# EAGLE design Gateway (EAGLE 9.6.2)
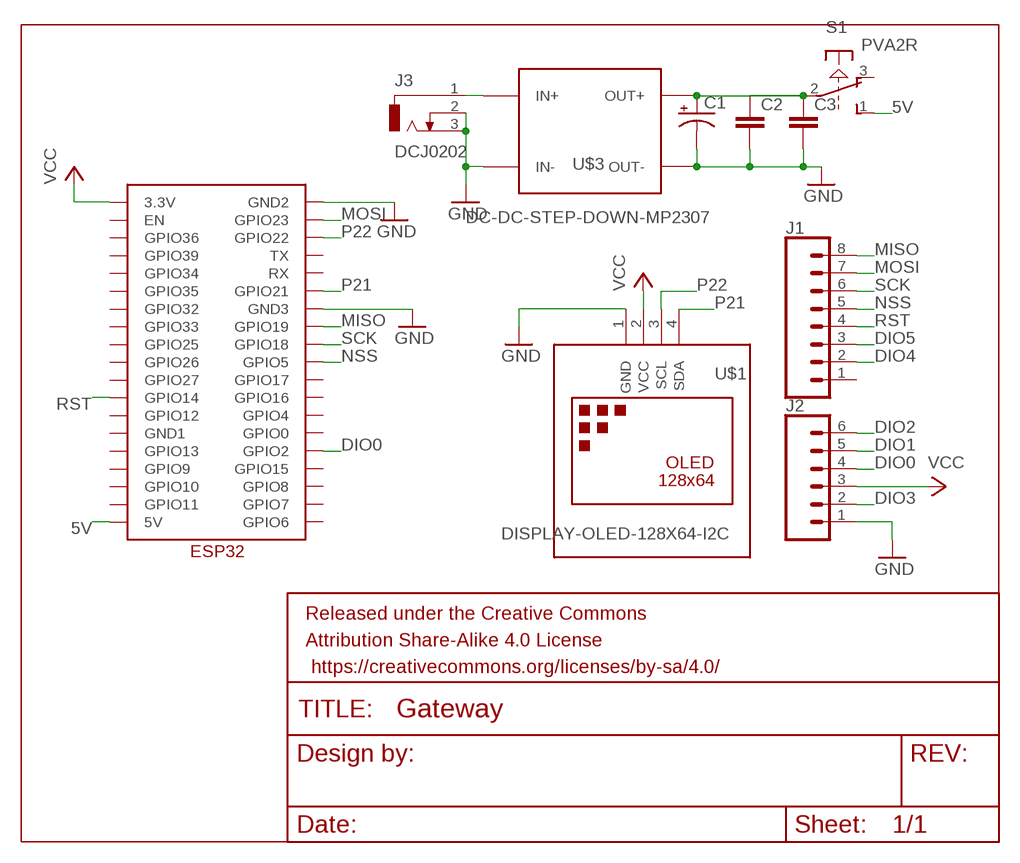
[diagram p0: schematic, sheet 1]

## Parts
C1  CPOL-USE2,5-6E  [E2,5-6E]
C2  C-EUC1206  [C1206]
C3  C-EUC1206  [C1206]
FRAME1  FRAME-LEDGER  [CREATIVE_COMMONS]
J1  CONN_08"  [1X08]
J2  CONN_06SILK_FEMALE_PTH  [1X06]
J3  DCJ0202  [DCJ0202]
S1  PVA2R  [PVA2R]
U$1  DISPLAY-OLED-128X64-I2C  [DISPLAY-OLED-128X64-I2C]
U$2  ESP32  [ESP32]
U$3  DC-DC-STEP-DOWN-MP2307  [DC-DC-STEP-DOWN-MP2307]

## Nets
5V: S1.1(1:S) U$2.5V
DIO0: J2.4 U$2.GPIO2
DIO1: J2.5
DIO2: J2.6
DIO3: J2.2
DIO4: J1.2
DIO5: J1.3
GND: C1.- C2.2 C3.2 J2.1 J3.2 J3.3 U$1.1(GND) U$2.GND2 U$2.GND3 U$3.IN- U$3.OUT-
MISO: J1.8 U$2.GPIO19
MOSI: J1.7 U$2.GPIO23
N$1: C1.+ C2.1 C3.1 S1.2(1:P) U$3.OUT+
N$2: J3.1 U$3.IN+
NSS: J1.5 U$2.GPIO5
P21: U$1.4(SDA) U$2.GPIO21
P22: U$1.3(SCL) U$2.GPIO22
RST: J1.4 U$2.GPIO14
SCK: J1.6 U$2.GPIO18
VCC: J2.3 U$1.2(VCC) U$2.3.3V
Unconnected: J1.1 S1.3(1:O) S1.4(2:S) S1.5(2:P) S1.6(2:O) U$2.EN U$2.GND1 U$2.GPIO0 U$2.GPIO4 U$2.GPIO6 U$2.GPIO7 U$2.GPIO8 U$2.GPIO9 U$2.GPIO10 U$2.GPIO11 U$2.GPIO12 U$2.GPIO13 U$2.GPIO15 U$2.GPIO16 U$2.GPIO17 U$2.GPIO25 U$2.GPIO26 U$2.GPIO27 U$2.GPIO32 U$2.GPIO33 U$2.GPIO34 U$2.GPIO35 U$2.GPIO36 U$2.GPIO39 U$2.RX U$2.TX

## Library data of the parts
C1 = rcl:CPOL-US: POLARIZED CAPACITOR, American symbol; SPICEPREFIX: C
C2 C3 = rcl:C-EU: CAPACITOR, European symbol; SPICEPREFIX: C
FRAME1 = SparkFun-Aesthetics:FRAME-LEDGER: Schematic Frame - Ledger Standard 11x14 US Ledger frame
J1 = SparkFun-Connectors:CONN_08: Multi connection point. Often used as Generic Header-pin footprint for 0.1 inch spaced/style header connections On any of the 0.1 inch spaced packages, you can populate with these: Break Away Headers - Straight <https://www.sparkfun.com/products/116> (PRT-00116) Break Away Male Headers - Right Angle <https://www.sparkfun.com/products/553> (PRT-00553) Female Headers <https://www.sparkfun.com/products/115> (PRT-00115) Break Away Headers - Machine Pin <https://www.sparkfun.com/products/117> (PRT-00117) Break Away Female Headers - Swiss Machine Pin <https://www.sparkfun.com/products/743> (PRT-00743) Arduino Stackable Header - 8 Pin <https://www.sparkfun.com/products/9279> (PRT-09279) For SCREWTERMINALS and SPRING TERMINALS visit here: Screw Terimnals on SparkFun.com <https://www.sparkfun.com/search/results?term=Screw+Terminals> (5mm/3.5mm/2.54mm spacing) This device is also useful as a general connection point to wire up your design to another part of your project. Our various solder wires solder well into these plated through hole pads. Hook-Up Wire - Assortment (Stranded, 22 AWG) <https://www.sparkfun.com/products/11375> (PRT-11375) Hook-Up Wire - Assortment (Solid Core, 22 AWG) <https://www.sparkfun.com/products/11367> (PRT-11367) View the entire wire category on our website here <https://www.sparkfun.com/categories/141> Special notes: Molex polarized connector foot print use with SKU : PRT-08231 with associated crimp pins and housings. 1MM SMD Version SKU: PRT-10208 NOTES ON THE VARIANTS LOCK and LOCK_LONGPADS... This footprint was designed to help hold the alignment of a through-hole component (i.e. 6-pin header) while soldering it into place. You may notice that each hole has been shifted either up or down by 0.005 of an inch from it's more standard position (which is a perfectly straight line). This slight alteration caused the pins (the squares in the middle) to touch the edges of the holes. Because they are alternating, it causes a "brace" to hold the component in place. 0.005 has proven to be the perfect amount of "off-center" position when using our standard breakaway headers. Although looks a little odd when you look at the bare footprint, once you have a header in there, the alteration is very hard to notice. Also,if you push a header all the way into place, it is covered up entirely on the bottom side.; PROD_ID: CONN-08438
J2 = SparkFun-Connectors:CONN_06: Multi connection point. Often used as Generic Header-pin footprint for 0.1 inch spaced/style header connections On any of the 0.1 inch spaced packages, you can populate with these: Break Away Headers - Straight <https://www.sparkfun.com/products/116> (PRT-00116) Break Away Male Headers - Right Angle <https://www.sparkfun.com/products/553> (PRT-00553) Female Headers <https://www.sparkfun.com/products/115> (PRT-00115) Break Away Headers - Machine Pin <https://www.sparkfun.com/products/117> (PRT-00117) Break Away Female Headers - Swiss Machine Pin <https://www.sparkfun.com/products/743> (PRT-00743) Arduino Stackable Header - 6 Pin <https://www.sparkfun.com/products/9280> (PRT-09280) For SCREWTERMINALS and SPRING TERMINALS visit here: Screw Terimnals on SparkFun.com <https://www.sparkfun.com/search/results?term=Screw+Terminals> (5mm/3.5mm/2.54mm spacing) This device is also useful as a general connection point to wire up your design to another part of your project. Our various solder wires solder well into these plated through hole pads. Hook-Up Wire - Assortment (Stranded, 22 AWG) <https://www.sparkfun.com/products/11375> (PRT-11375) Hook-Up Wire - Assortment (Solid Core, 22 AWG) <https://www.sparkfun.com/products/11367> (PRT-11367) View the entire wire category on our website here <https://www.sparkfun.com/categories/141>; PROD_ID: CONN-08437
J3 = con-jack:DCJ0202: DC POWER JACK Source: DCJ0202.pdf; OC_FARNELL: unknown; OC_NEWARK: unknown
S1 = switch-misc:PVA2R: ITT SWITCH
U$1 = diy-modules:DISPLAY-OLED-128X64-I2C: 128x64 Dot Matrix OLED Module based on SSD1306 chip Variant with I2C interface More details available here: http://www.instructables.com/id/Monochrome-096-i2c-OLED-display-with-arduino-SSD13/ SSD1306 datasheet: https://cdn-shop.adafruit.com/datasheets/SSD1306.pdf Click here to find device on ebay.com <http://www.ebay.com/sch/oled+display+128x64+iic> Note: There are two variants: I2C and SPI. Search for the proper version.
U$2 = ESP32:ESP32
U$3 = diy-modules:DC-DC-STEP-DOWN-MP2307: DC/DC Step-Down Regulator based on MP2307DN chip MP2307 datasheet available here: https://cdn-shop.adafruit.com/datasheets/MP2307_r1.9.pdf Click here to find device on ebay.com <http://www.ebay.com/sch/dc+dc+3a+mini+converter>

## Board
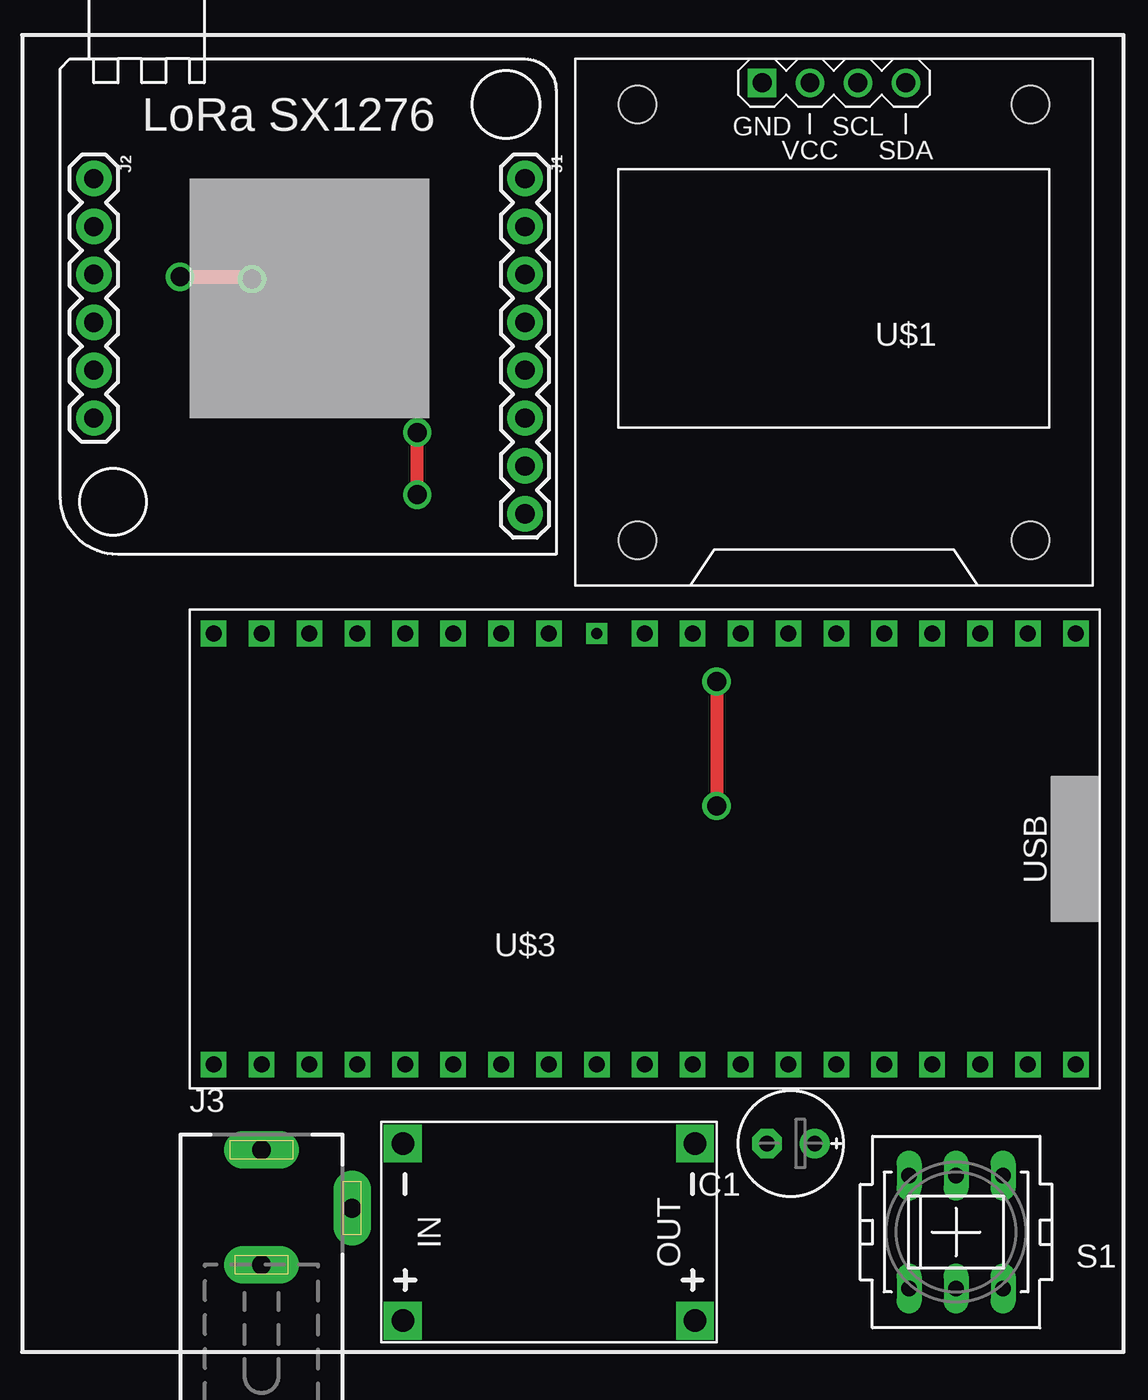
[diagram p1: board, top side]
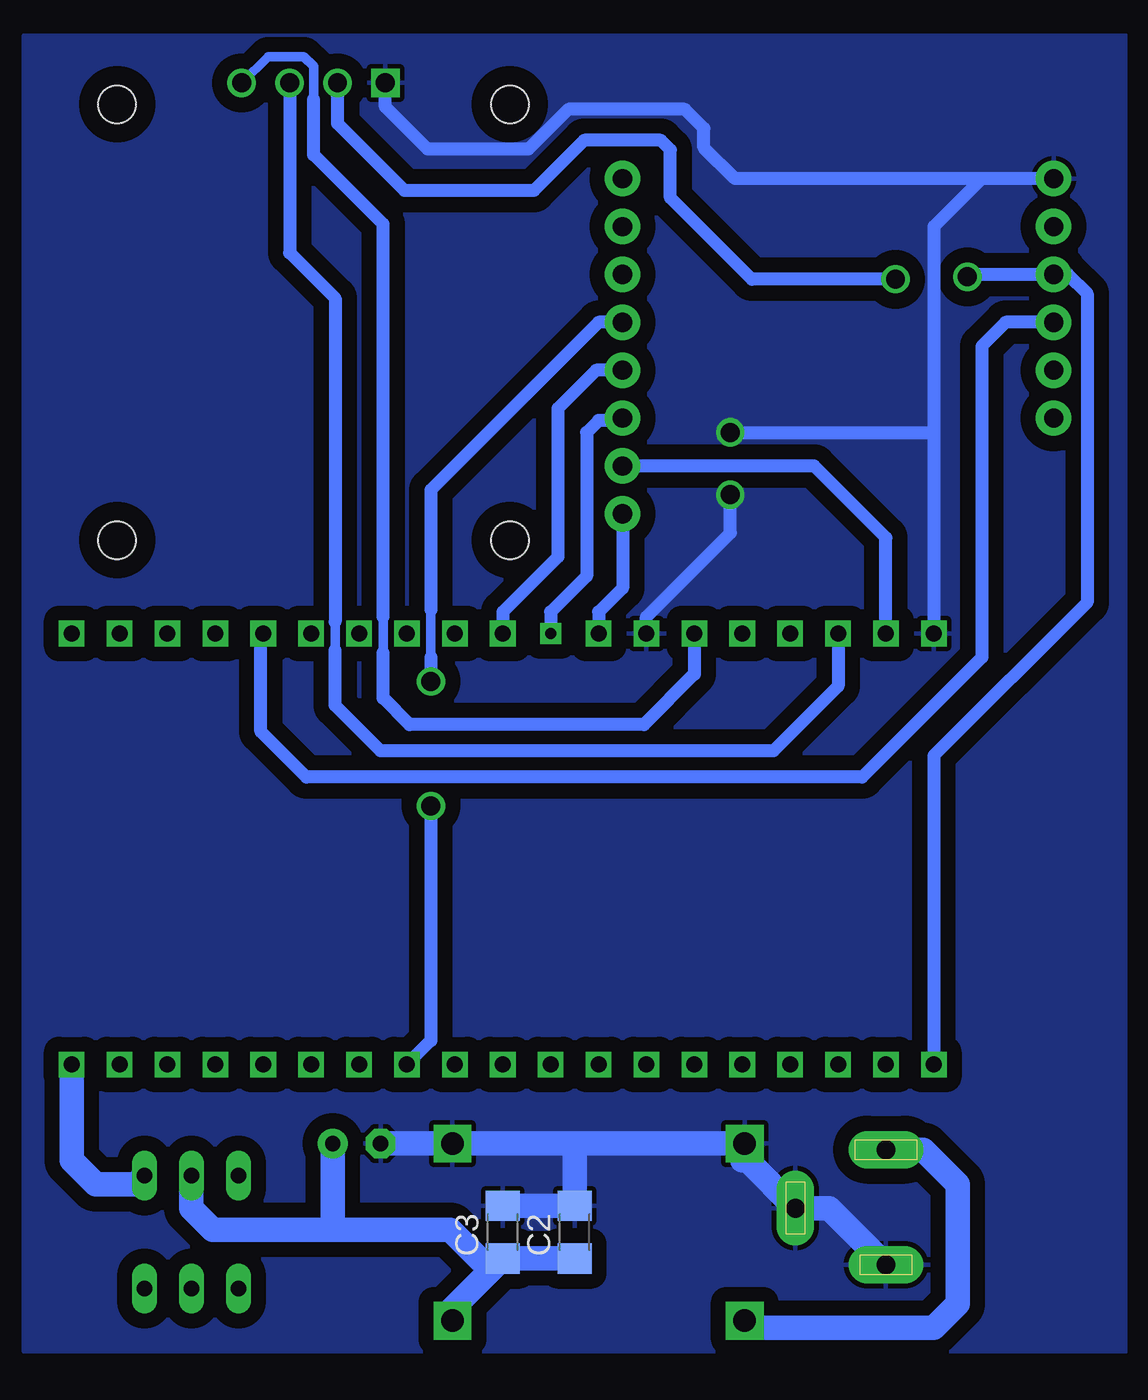
[diagram p2: board, bottom side, seen from below]

No outline drawn. Coordinates in mm, seen from the top.
Copper layers (1*16): Top 0.035mm / dielectric 1.5mm / Bottom 0.035mm
Design rules "default": minimum track width 6mil, minimum drill 0.35mm, track to track 6mil, track to pad 6mil, pad to pad 6mil, via to via 6mil, smd to smd 6mil, copper to edge 40mil, drill to drill 6mil, minimum pad ring 10mil, minimum via ring 8mil, stop-mask expansion 4mil, vias tented up to drill 0mil, thermal gap 10mil

### Footprints (pad centres in the part's own frame; a part is rotated, then mirrored left to right if it is on the bottom)
E2,5-6E = drill 0.813 pad 1.575: + -1.27,0 | drill 0.813 pad 1.575 octagon: - 1.27,0
C1206 = smd 1.6 x 1.8: 1 -1.4,0; 2 1.4,0
1X08 = drill 1.016 pad 1.88: 1 0,0; 2 2.54,0; 3 5.08,0; 4 7.62,0; 5 10.16,0; 6 12.7,0; 7 15.24,0; 8 17.78,0
1X06 = drill 1.016 pad 1.88: 1 0,0; 2 2.54,0; 3 5.08,0; 4 7.62,0; 5 10.16,0; 6 12.7,0
DCJ0202 = drill 1 pad 2 long: 1 0,3.1; 2 4.8,0; 3 0,-3
PVA2R = drill 0.813 long: 1 -2.997,2.489; 2 -2.997,0; 3 -2.997,-2.489; 4 2.997,2.489; 5 2.997,0; 6 2.997,-2.489
DISPLAY-OLED-128X64-I2C = drill 1 square: 1 -3.81,12.7 | drill 1: 2 -1.27,12.7; 3 1.27,12.7; 4 3.81,12.7 | hole 2: -10.414,11.557; 10.414,11.557; 10.414,-11.557; -10.414,-11.557
ESP32 = drill 0.85 square: 3.3V 1.27,46.99; 5V 1.27,1.27; EN 1.27,44.45; GND1 1.27,13.97; GND2 24.13,46.99; GND3 24.13,31.75; GPIO0 24.13,13.97; GPIO2 24.13,11.43; GPIO4 24.13,16.51; GPIO5 24.13,24.13; GPIO6 24.13,1.27; GPIO7 24.13,3.81; GPIO8 24.13,6.35; GPIO9 1.27,8.89; GPIO10 1.27,6.35; GPIO11 1.27,3.81; GPIO12 1.27,16.51; GPIO13 1.27,11.43; GPIO14 1.27,19.05; GPIO15 24.13,8.89; GPIO16 24.13,19.05; GPIO17 24.13,21.59; GPIO19 24.13,29.21; GPIO21 24.13,34.29; GPIO22 24.13,41.91; GPIO23 24.13,44.45; GPIO25 1.27,26.67; GPIO26 1.27,24.13; GPIO27 1.27,21.59; GPIO32 1.27,31.75; GPIO33 1.27,29.21; GPIO34 1.27,36.83; GPIO35 1.27,34.29; GPIO36 1.27,41.91; GPIO39 1.27,39.37; RX 24.13,36.83; TX 24.13,39.37 | drill 0.6 square: GPIO18 24.13,26.67
DC-DC-STEP-DOWN-MP2307 = drill 1.2 pad 2 square: IN+ -7.747,-4.699; IN- -7.747,4.699; OUT+ 7.747,-4.699; OUT- 7.747,4.699

### Placement (x,y rotation side)
C1  44.58,4.7 180 top
C2  33.02,0 90 bottom
C3  36.83,0 90 bottom
FRAME1  16.51,-29.21 0 top
J1  30.48,55.88 270 top
J2  7.62,55.88 270 top
J3  16.51,1.27 0 top
S1  53.34,0 270 top
U$1  46.86,48.26 0 top
U$2  60.96,7.62 90 top
U$3  31.75,0 0 top

### Tracks (layer width: path | path; a pad name or v marks a point on that pad's centre or on a via)
5V
  Bottom 1.3: U$2.5V 59.69,3.81 58.42,2.54 56.29,2.54 S1.1
DIO0
  Bottom 0.7: J2.4 10.16,48.26 11.43,46.99 11.43,30.48 17.78,24.13 47.24,24.13 49.66,26.54 49.66,31.62 U$2.GPIO2
GND  (via drill 1)
  Top 0.7: v24.77,39.12 v24.77,42.42
  Bottom 0.7: J2.1 11.43,55.88 | 11.43,55.88 13.97,53.34 13.97,50.8 13.97,42.55 | 13.97,42.55 U$2.GND2 | U$2.GND3 29.21,32.64 24.77,37.08 v24.77,39.12 | v24.77,42.42 14.1,42.42 13.97,42.55 | 11.43,55.88 24.51,55.88 26.16,57.53 26.16,58.55 27.18,59.56 33.36,59.56 35.47,57.45 40.81,57.45 43.05,59.69 U$1.1
  Bottom 1.3: J3.3 19.51,1.27 J3.2 23.85,3.81 24.13,3.81 24.13,4.57 U$3.IN- 33.02,4.7 | 33.02,4.7 U$3.OUT- C1.- | 33.02,4.7 C2.2 C3.2
  pour Bottom (isolate 0.8): 3.81,63.5 3.81,-6.35 62.23,-6.35 62.23,63.5
MISO
  Bottom 0.7: U$2.GPIO19 31.75,32.89 30.48,34.16 J1.8
MOSI
  Bottom 0.7: U$2.GPIO23 16.51,36.83 20.32,40.64 J1.7
N$1
  Bottom 1.3: C2.1 C3.1 37.46,-2.03 | 37.46,-2.03 39.5,-4.07 U$3.OUT+ | S1.2 53.34,1.27 52.2,0.13 45.85,0.13 | 37.46,-2.03 39.62,0.13 45.85,0.13 | C1.+ 45.85,0.13
N$2
  Bottom 1.3: J3.1 14.53,4.37 12.7,2.54 12.7,-3.81 13.97,-5.08 23.62,-5.08 U$3.IN+
NSS
  Bottom 0.7: J1.5 31.88,45.72 33.91,43.69 33.91,35.81 36.83,32.89 U$2.GPIO5
P21
  Bottom 0.5: 43.18,30.73 43.18,32.64 | 46.86,60.07 46.86,61.85 47.37,62.36 49.28,62.36 U$1.4
  Bottom 0.7: U$2.GPIO21 26.67,29.59 29.34,26.92 41.78,26.92 43.18,28.32 43.18,30.73 | 46.86,60.07 46.86,57.15 43.18,53.47 43.18,32.64
P22
  Bottom 0.5: 45.72,32.38 45.72,30.86
  Bottom 0.7: U$2.GPIO22 19.05,28.96 22.48,25.53 43.31,25.53 45.72,27.94 45.72,30.86 | U$1.3 48.13,51.94 45.72,49.53 45.72,32.38
RST  (via drill 1)
  Top 0.7: v40.64,29.21 v40.64,22.61
  Bottom 0.5: 40.64,33.02 40.64,30.48
  Bottom 0.7: J1.4 31.75,48.26 40.64,39.37 40.64,33.02 | 40.64,30.48 v40.64,29.21 | U$2.GPIO14 40.64,10.16 v40.64,22.61
SCK
  Bottom 0.7: J1.6 30.61,43.05 31.75,43.05 32.38,42.42 32.38,34.8 34.29,32.89 U$2.GPIO18
VCC  (via drill 1)
  Top 0.7: v12.19,50.67 15.88,50.67 v16,50.55
  Bottom 0.7: U$2.3.3V 13.97,25.27 5.84,33.4 5.84,49.78 6.86,50.8 J2.3 12.06,50.8 v12.19,50.67 | v16,50.55 23.62,50.55 27.94,54.86 27.94,57.4 28.45,57.91 32.51,57.91 35.18,55.24 42.04,55.24 45.59,58.8 U$1.2

### Text on the board
tPlace: LoRa SX1276